# EAGLE design Axios_sensor_connection_autorouted (EAGLE 9.5.1)
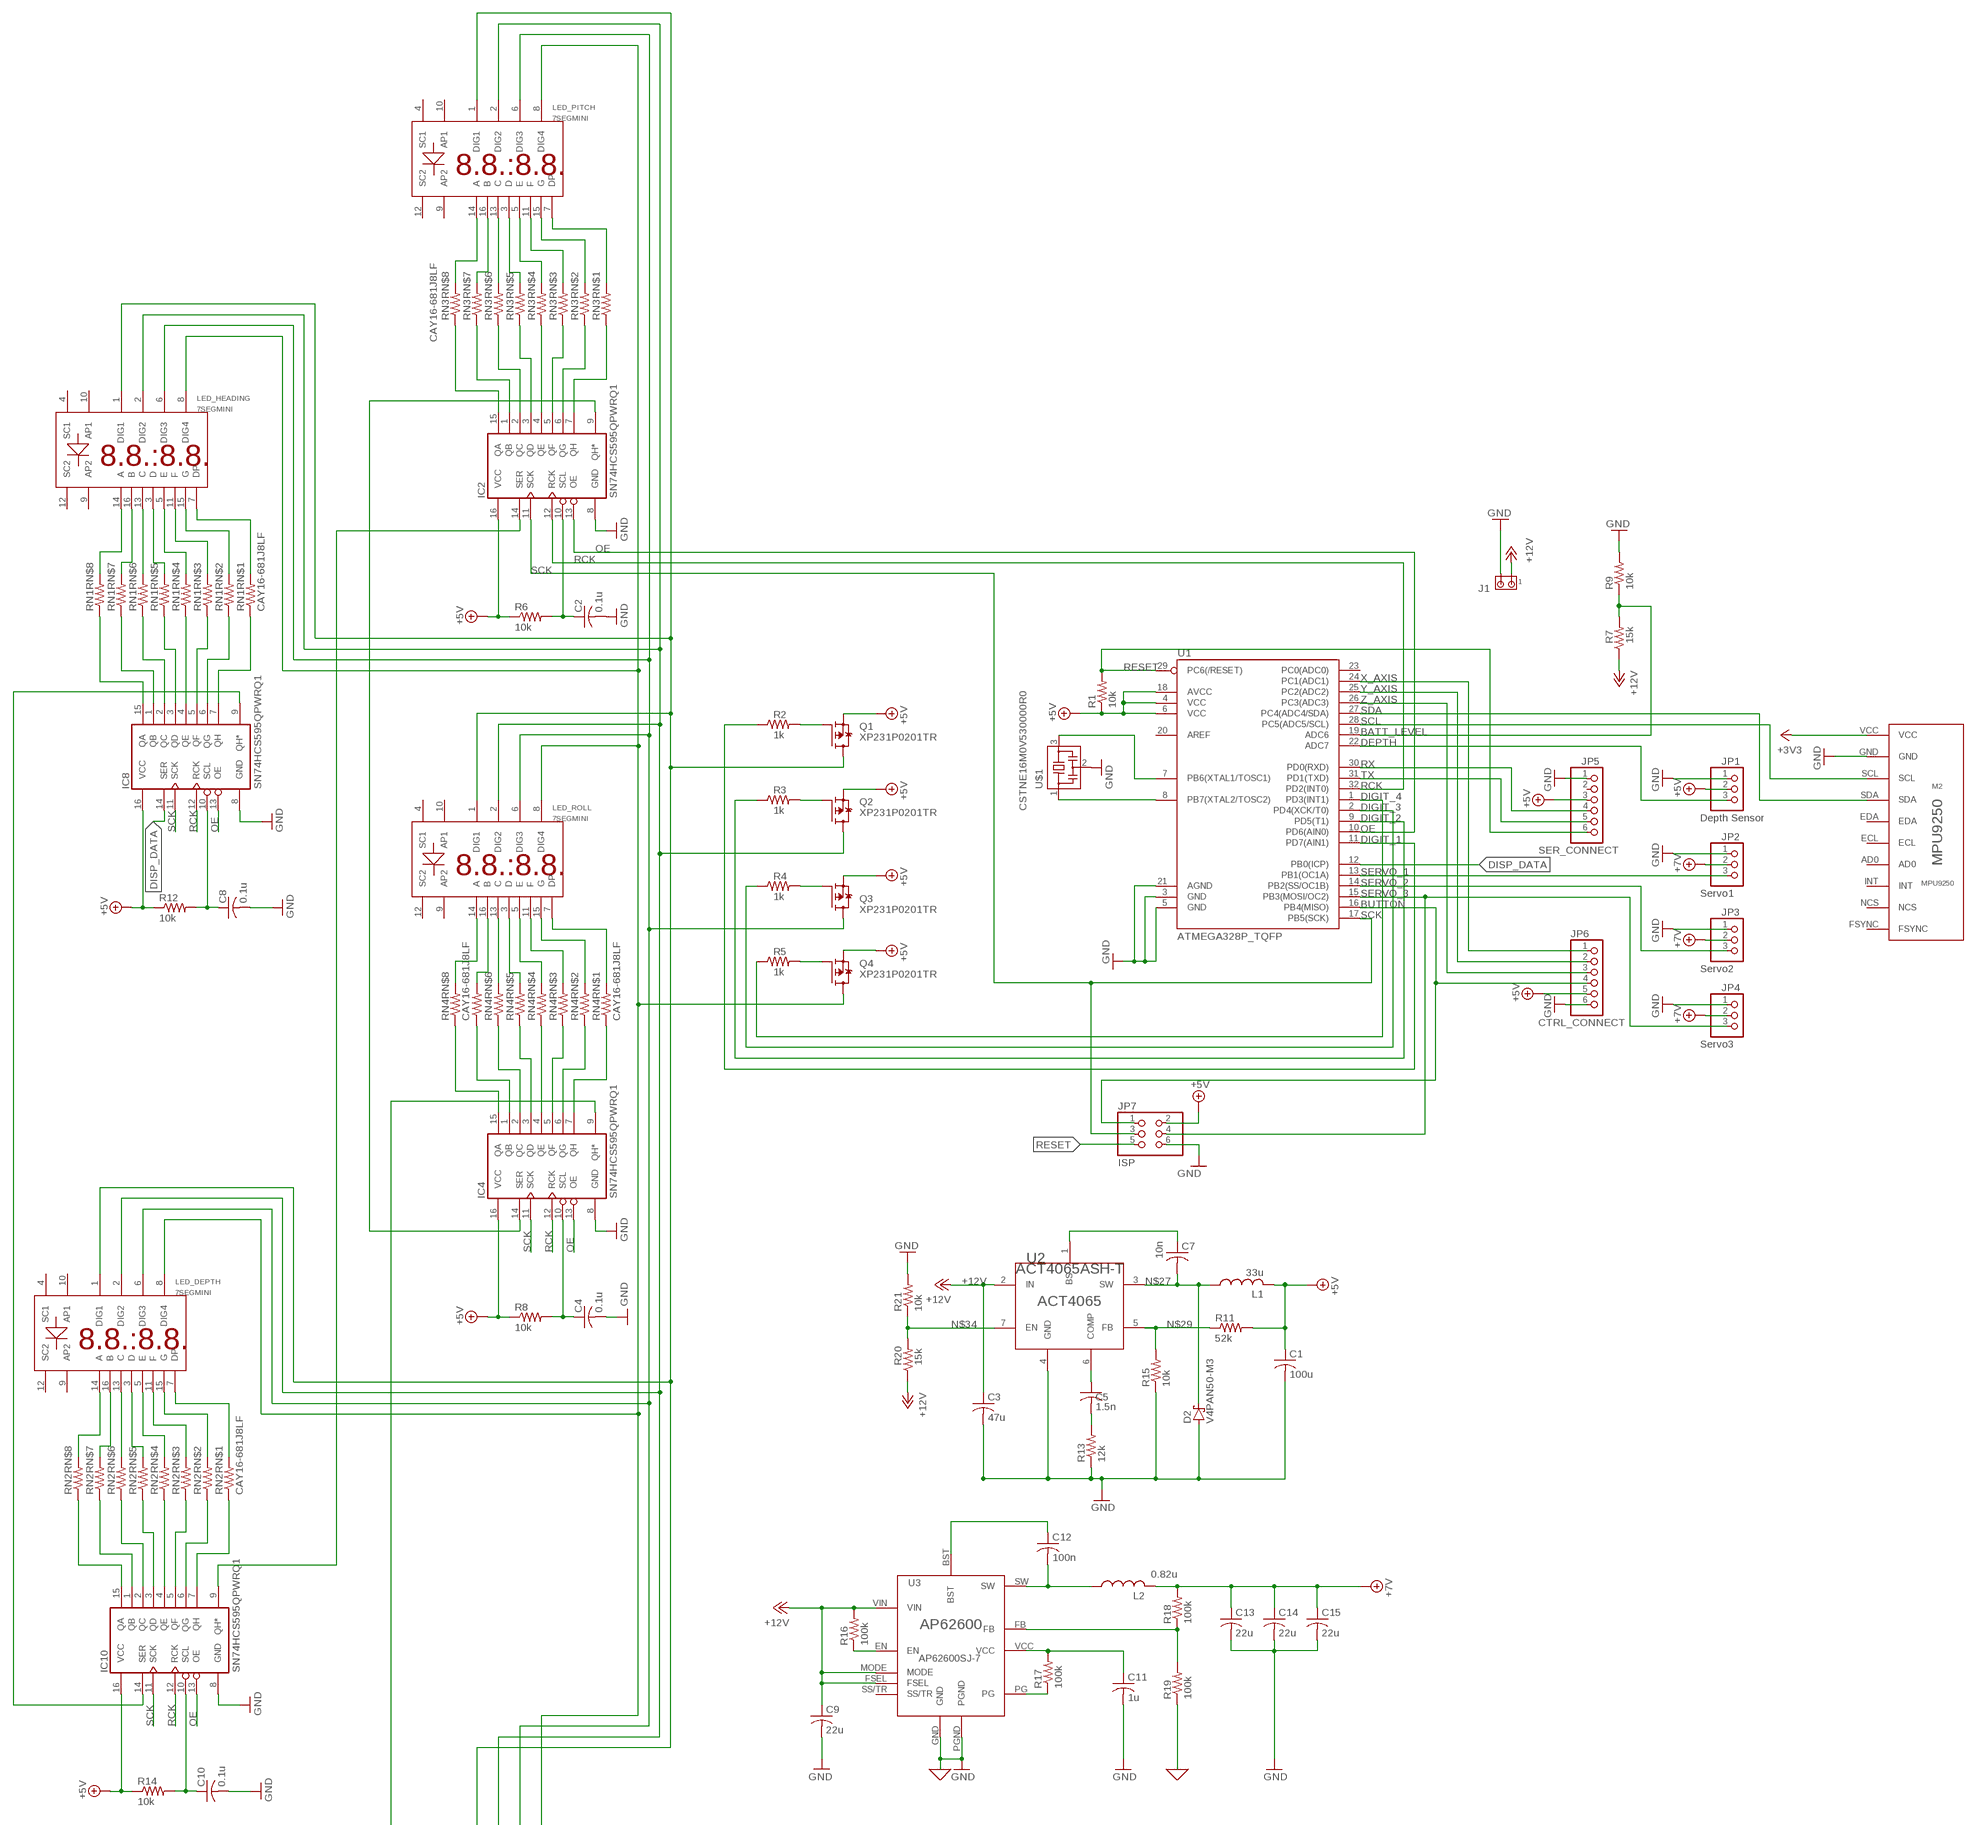
[diagram p0: schematic, sheet 1, part 1 of 2]
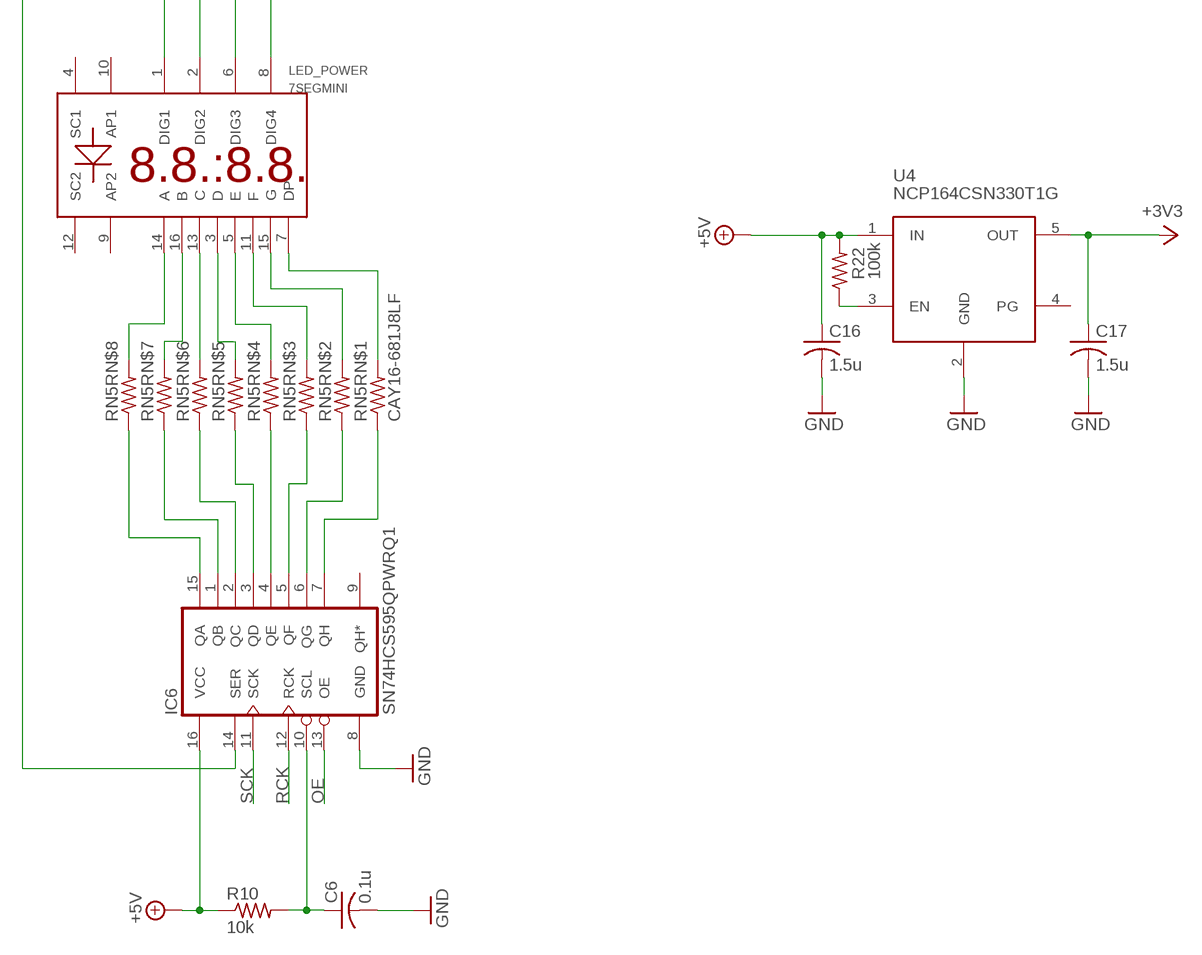
[diagram p1: schematic, sheet 1, part 2 of 2]

## Parts
C1  100u  C-USC0603  [C0603]
C2  0.1u  C-USC0603  [C0603]
C3  47u  C-USC0603  [C0603]
C4  0.1u  C-USC0603  [C0603]
C5  1.5n  C-USC0603  [C0603]
C6  0.1u  C-USC0603  [C0603]
C7  10n  C-USC0603  [C0603]
C8  0.1u  C-USC0603  [C0603]
C9  22u  C-USC0603  [C0603]
C10  0.1u  C-USC0603  [C0603]
C11  1u  C-USC0603  [C0603]
C12  100n  C-USC0603  [C0603]
C13  22u  C-USC0603  [C0603]
C14  22u  C-USC0603  [C0603]
C15  22u  C-USC0603  [C0603]
C16  1.5u  C-USC0603  [C0603]
C17  1.5u  C-USC0603  [C0603]
D2  V4PAN50-M3  [SMPA]
IC2  SN74HCS595QPWRQ1  [TSSOP16]
IC4  SN74HCS595QPWRQ1  [TSSOP16]
IC6  SN74HCS595QPWRQ1  [TSSOP16]
IC8  SN74HCS595QPWRQ1  [TSSOP16]
IC10  SN74HCS595QPWRQ1  [TSSOP16]
J1  MTA02-156  [1X2MTA]
JP1  Depth Sensor  PINHD-1X3  [1X03]
JP2  Servo1  PINHD-1X3  [1X03]
JP3  Servo2  PINHD-1X3  [1X03]
JP4  Servo3  PINHD-1X3  [1X03]
JP5  SER_CONNECT  PINHD-1X6  [1X06]
JP6  CTRL_CONNECT  PINHD-1X6  [1X06]
JP7  ISP  PINHD-2X3  [2X03]
L1  33u  SRN1060-330M  [SRN1060-330M]
L2  0.82u  ECS-MPIL0630-R82MC  [ECS-MPIL0630-R82MC]
LED_DEPTH  7SEGMINI  [7SEGMINI]
LED_HEADING  7SEGMINI  [7SEGMINI]
LED_PITCH  7SEGMINI  [7SEGMINI]
LED_POWER  7SEGMINI  [7SEGMINI]
LED_ROLL  7SEGMINI  [7SEGMINI]
M2  MPU9250  [MPU9250]
Q1  XP231P0201TR  [SOT23]
Q2  XP231P0201TR  [SOT23]
Q3  XP231P0201TR  [SOT23]
Q4  XP231P0201TR  [SOT23]
R1  10k  R-US_R0603  [R0603]
R2  1k  R-US_R0603  [R0603]
R3  1k  R-US_R0603  [R0603]
R4  1k  R-US_R0603  [R0603]
R5  1k  R-US_R0603  [R0603]
R6  10k  R-US_R0603  [R0603]
R7  15k  R-US_R0603  [R0603]
R8  10k  R-US_R0603  [R0603]
R9  10k  R-US_R0603  [R0603]
R10  10k  R-US_R0603  [R0603]
R11  52k  R-US_R0603  [R0603]
R12  10k  R-US_R0603  [R0603]
R13  12k  R-US_R0603  [R0603]
R14  10k  R-US_R0603  [R0603]
R15  10k  R-US_R0603  [R0603]
R16  100k  R-US_R0603  [R0603]
R17  100k  R-US_R0603  [R0603]
R18  100k  R-US_R0603  [R0603]
R19  100k  R-US_R0603  [R0603]
R20  15k  R-US_R0603  [R0603]
R21  10k  R-US_R0603  [R0603]
R22  100k  R-US_R0603  [R0603]
RN1  CAY16-681J8LF  [CAY16-681J8LF]
RN2  CAY16-681J8LF  [CAY16-681J8LF]
RN3  CAY16-681J8LF  [CAY16-681J8LF]
RN4  CAY16-681J8LF  [CAY16-681J8LF]
RN5  CAY16-681J8LF  [CAY16-681J8LF]
U1  ATMEGA328P_TQFP  [TQFP32-08]
U2  ACT4065ASH-T  [SO8]
U3  AP62600SJ-7  [V-QFN2030-12]
U4  NCP164CSN330T1G  [TSOP-5]
U$1  CSTNE16M0V530000R0  [CSTCR6M]

## Nets
0: R19.1 U3.GND U3.PGND ; supply symbol labelled GND
+3V3 [Low Power]: C17.1 M2.VCC U4.5(OUT)
+5V [Low Power]: C1.1 C16.1 IC2.16(VCC) IC4.16(VCC) IC6.16(VCC) IC8.16(VCC) IC10.16(VCC) JP1.2 JP2.2 JP3.2 JP4.2 JP5.3 JP6.5 JP7.2 L1.P$2 Q1.2(S) Q2.2(S) Q3.2(S) Q4.2(S) R6.1 R8.1 R10.1 R11.2 R12.1 R14.1 R22.2 U4.1(IN) ; supply symbol labelled +7V
+7V [Low Power]: C13.1 C14.1 C15.1 L2.P$2 R18.2
+12V [Low Power]: C3.1 C9.1 J1.1 R7.1 R16.2 R20.1 U2.2(IN) U3.FSEL U3.MODE U3.VIN
BATT_LEVEL [Digital]: R7.2 R9.1 U1.19(ADC6)
BUTTON: JP6.4 JP7.1 U1.16(PB4(MISO))
DEPTH [Analog]: JP1.3 U1.22(ADC7)
DIGIT_1 [Digital]: R2.1 U1.11(PD7(AIN1))
DIGIT_2 [Digital]: R3.1 U1.9(PD5(T1))
DIGIT_3 [Digital]: R4.1 U1.2(PD4(XCK/T0))
DIGIT_4 [Digital]: R5.1 U1.1(PD3(INT1))
DISP_DATA [Digital]: IC8.14(SER) U1.12(PB0(ICP))
GND [Medium Power]: C1.2 C2.2 C3.2 C4.2 C6.2 C8.2 C9.2 C10.2 C11.2 C13.2 C14.2 C15.2 C16.2 C17.2 D2.A IC2.8(GND) IC4.8(GND) IC6.8(GND) IC8.8(GND) IC10.8(GND) JP1.1 JP2.1 JP3.1 JP4.1 JP5.1 JP6.6 JP7.6 M2.GND R9.2 R13.1 R15.1 R21.2 U1.3(GND) U1.5(GND) U1.21(AGND) U2.4(GND) U4.2(GND) U$1.2
GND1: R17.1 U3.PG
GND2: R16.1 U3.EN
N$3: R1.1 U1.4(VCC) U1.6(VCC) U1.18(AVCC) ; supply symbol labelled +5V
N$5: IC8.9(QH*) IC10.14(SER)
N$7: U1.8(PB7(XTAL2/TOSC2)) U$1.1
N$12: U1.7(PB6(XTAL1/TOSC1)) U$1.3
N$17: C7.1 U2.1(BS)
N$21: Q1.1(G) R2.2
N$23: Q2.1(G) R3.2
N$24: Q3.1(G) R4.2
N$25: Q4.1(G) R5.2
N$27: C7.2 D2.C L1.P$1 U2.3(SW)
N$29: R11.1 R15.2 U2.5(FB)
N$30: R22.1 U4.3(EN)
N$31: C5.2 R13.2
N$32: J1.2 ; supply symbol labelled GND
N$34: R20.2 R21.1 U2.7(EN)
N$35: C5.1 U2.6(COMP)
N$36: C11.1 R17.2 U3.VCC
N$37: C12.2 L2.P$1 U3.SW
N$42: R18.1 R19.2 U3.FB
N$45: LED_PITCH.14(A) RN3.9
N$46: LED_PITCH.16(B) RN3.10
N$47: LED_PITCH.13(C) RN3.11
N$48: LED_PITCH.3(D) RN3.12
N$49: LED_PITCH.5(E) RN3.13
N$50: LED_PITCH.11(F) RN3.14
N$51: LED_PITCH.15(G) RN3.15
N$52: LED_PITCH.7(DP) RN3.16
N$53: IC2.15(QA) RN3.8
N$54: IC2.1(QB) RN3.7
N$55: IC2.2(QC) RN3.6
N$56: IC2.3(QD) RN3.5
N$57: IC2.4(QE) RN3.4
N$58: IC2.5(QF) RN3.3
N$59: IC2.6(QG) RN3.2
N$60: IC2.7(QH) RN3.1
N$61: C2.1 IC2.10(SCL) R6.2
N$62: C12.1 U3.BST
N$65: IC2.14(SER) IC10.9(QH*)
N$95: LED_ROLL.14(A) RN4.9
N$96: LED_ROLL.16(B) RN4.10
N$97: LED_ROLL.13(C) RN4.11
N$98: LED_ROLL.3(D) RN4.12
N$99: LED_ROLL.5(E) RN4.13
N$100: LED_ROLL.11(F) RN4.14
N$101: LED_ROLL.15(G) RN4.15
N$102: LED_ROLL.7(DP) RN4.16
N$103: IC4.15(QA) RN4.8
N$104: IC4.1(QB) RN4.7
N$105: IC4.2(QC) RN4.6
N$106: IC4.3(QD) RN4.5
N$107: IC4.4(QE) RN4.4
N$108: IC4.5(QF) RN4.3
N$109: IC4.6(QG) RN4.2
N$110: IC4.7(QH) RN4.1
N$111: C4.1 IC4.10(SCL) R8.2
N$115: IC2.9(QH*) IC4.14(SER)
N$145: LED_POWER.14(A) RN5.9
N$146: LED_POWER.16(B) RN5.10
N$147: LED_POWER.13(C) RN5.11
N$148: LED_POWER.3(D) RN5.12
N$149: LED_POWER.5(E) RN5.13
N$150: LED_POWER.11(F) RN5.14
N$151: LED_POWER.15(G) RN5.15
N$152: LED_POWER.7(DP) RN5.16
N$153: IC6.15(QA) RN5.8
N$154: IC6.1(QB) RN5.7
N$155: IC6.2(QC) RN5.6
N$156: IC6.3(QD) RN5.5
N$157: IC6.4(QE) RN5.4
N$158: IC6.5(QF) RN5.3
N$159: IC6.6(QG) RN5.2
N$160: IC6.7(QH) RN5.1
N$161: C6.1 IC6.10(SCL) R10.2
N$165: IC4.9(QH*) IC6.14(SER)
N$195: LED_HEADING.14(A) RN1.9
N$196: LED_HEADING.16(B) RN1.10
N$197: LED_HEADING.13(C) RN1.11
N$198: LED_HEADING.3(D) RN1.12
N$199: LED_HEADING.5(E) RN1.13
N$200: LED_HEADING.11(F) RN1.14
N$201: LED_HEADING.15(G) RN1.15
N$202: LED_HEADING.7(DP) RN1.16
N$203: IC8.15(QA) RN1.8
N$204: IC8.1(QB) RN1.7
N$205: IC8.2(QC) RN1.6
N$206: IC8.3(QD) RN1.5
N$207: IC8.4(QE) RN1.4
N$208: IC8.5(QF) RN1.3
N$209: IC8.6(QG) RN1.2
N$210: IC8.7(QH) RN1.1
N$211: C8.1 IC8.10(SCL) R12.2
N$241: LED_DEPTH.1(DIG1) LED_HEADING.1(DIG1) LED_PITCH.1(DIG1) LED_POWER.1(DIG1) LED_ROLL.1(DIG1) Q1.3(D)
N$242: LED_DEPTH.2(DIG2) LED_HEADING.2(DIG2) LED_PITCH.2(DIG2) LED_POWER.2(DIG2) LED_ROLL.2(DIG2) Q2.3(D)
N$243: LED_DEPTH.6(DIG3) LED_HEADING.6(DIG3) LED_PITCH.6(DIG3) LED_POWER.6(DIG3) LED_ROLL.6(DIG3) Q3.3(D)
N$244: LED_DEPTH.8(DIG4) LED_HEADING.8(DIG4) LED_PITCH.8(DIG4) LED_POWER.8(DIG4) LED_ROLL.8(DIG4) Q4.3(D)
N$245: LED_DEPTH.14(A) RN2.9
N$246: LED_DEPTH.16(B) RN2.10
N$247: LED_DEPTH.13(C) RN2.11
N$248: LED_DEPTH.3(D) RN2.12
N$249: LED_DEPTH.5(E) RN2.13
N$250: LED_DEPTH.11(F) RN2.14
N$251: LED_DEPTH.15(G) RN2.15
N$252: LED_DEPTH.7(DP) RN2.16
N$253: IC10.15(QA) RN2.8
N$254: IC10.1(QB) RN2.7
N$255: IC10.2(QC) RN2.6
N$256: IC10.3(QD) RN2.5
N$257: IC10.4(QE) RN2.4
N$258: IC10.5(QF) RN2.3
N$259: IC10.6(QG) RN2.2
N$260: IC10.7(QH) RN2.1
N$261: C10.1 IC10.10(SCL) R14.2
OE [Digital]: IC2.13(OE) IC4.13(OE) IC6.13(OE) IC8.13(OE) IC10.13(OE) U1.10(PD6(AIN0))
RCK [Digital]: IC2.12(RCK) IC4.12(RCK) IC6.12(RCK) IC8.12(RCK) IC10.12(RCK) U1.32(PD2(INT0))
RESET [Digital]: JP5.6 JP7.5 R1.2 U1.29(PC6(/RESET))
RX: JP5.4 U1.30(PD0(RXD))
SCK [Digital]: IC2.11(SCK) IC4.11(SCK) IC6.11(SCK) IC8.11(SCK) IC10.11(SCK) JP7.3 U1.17(PB5(SCK))
SCL [Digital]: M2.SCL U1.28(PC5(ADC5/SCL))
SDA [Digital]: M2.SDA U1.27(PC4(ADC4/SDA))
SERVO_1 [Medium Power]: JP2.3 U1.13(PB1(OC1A))
SERVO_2 [Medium Power]: JP3.3 U1.14(PB2(SS/OC1B))
SERVO_3 [Medium Power]: JP4.3 JP7.4 U1.15(PB3(MOSI/OC2))
TX: JP5.5 U1.31(PD1(TXD))
X_AXIS [Digital]: JP6.1 U1.24(PC1(ADC1))
Y_AXIS [Digital]: JP6.2 U1.25(PC2(ADC2))
Z_AXIS [Digital]: JP6.3 U1.26(PC3(ADC3))
Unconnected: IC6.9(QH*) JP5.2 LED_DEPTH.4(SC1) LED_DEPTH.9(AP2) LED_DEPTH.10(AP1) LED_DEPTH.12(SC2) LED_HEADING.4(SC1) LED_HEADING.9(AP2) LED_HEADING.10(AP1) LED_HEADING.12(SC2) LED_PITCH.4(SC1) LED_PITCH.9(AP2) LED_PITCH.10(AP1) LED_PITCH.12(SC2) LED_POWER.4(SC1) LED_POWER.9(AP2) LED_POWER.10(AP1) LED_POWER.12(SC2) LED_ROLL.4(SC1) LED_ROLL.9(AP2) LED_ROLL.10(AP1) LED_ROLL.12(SC2) M2.AD0 M2.ECL M2.EDA M2.FSYNC M2.INT M2.NCS U1.20(AREF) U1.23(PC0(ADC0)) U3.SS/TR U4.4(PG)

## Library data of the parts
C1-C17 = rcl:C-US: CAPACITOR, American symbol; SPICEPREFIX: C
D2 = axios_components:V4PAN50-M3
IC2 IC4 IC6 IC8 IC10 = axios_components:SN74HCS595QPWRQ1
J1 = con-amp:MTA02-156: AMP connector
JP1-JP4 = pinhead:PINHD-1X3: PIN HEADER
JP5 JP6 = pinhead:PINHD-1X6: PIN HEADER
JP7 = pinhead:PINHD-2X3: PIN HEADER
L1 = axios_components:SRN1060-330M
L2 = axios_components:ECS-MPIL0630-R82MC
LED_DEPTH LED_HEADING LED_PITCH LED_POWER LED_ROLL = axios_components:7SEGMINI
M2 = diy-modules:MPU9250
Q1-Q4 = axios_components:XP231P0201TR: P-Channel Enhancement mode MOSFET 200 mA
R1-R22 = rcl:R-US_: RESISTOR, American symbol; SPICEPREFIX: R
RN1-RN5 = axios_components:CAY16-681J8LF
U1 = axios_components:ATMEGA328P_TQFP: Popular 328P in QFP Storefront component: ATmega328 - TQFP <https://www.sparkfun.com/products/13448> (COM-13448) Datasheet <http://www.sparkfun.com/datasheets/Components/SMD/ATMega328.pdf> SparkFun Products SparkFun RedBoard - Programmed with Arduino <https://www.sparkfun.com/products/12757> (DEV-12757) Arduino Pro Mini 328 - 5V/16MHz <https://www.sparkfun.com/products/11113> (DEV-11113) Arduino Pro Mini 328 - 3.3V/8MHz <https://www.sparkfun.com/products/11114> (DEV-11114) SparkFun OpenLog <https://www.sparkfun.com/products/13712> (DEV-13712) SparkFun MicroView - OLED Arduino Module <https://www.sparkfun.com/products/12923> (DEV-12923) SparkFun Digital Sandbox <https://www.sparkfun.com/products/12651> (DEV-12651) SparkFun PicoBoard <https://www.sparkfun.com/products/11888> (WIG-11888) Arduino Fio <https://www.sparkfun.com/products/10116> (DEV-10116) LilyPad Arduino 328 Main Board <https://www.sparkfun.com/products/13342> (DEV-13342) SparkFun RedStick <https://www.sparkfun.com/products/13741> (DEV-13741) LilyPad MP3 <https://www.sparkfun.com/products/11013> (DEV-11013) LilyPad Arduino SimpleSnap <https://www.sparkfun.com/products/10941> (DEV-10941) SparkFun Stepoko <https://www.sparkfun.com/products/13899> (ROB-13899) SparkFun Geiger Counter <https://www.sparkfun.com/products/11345> (SEN-11345) SparkFun EL Sequencer <https://www.sparkfun.com/products/12781> (COM-12781) Arduino Pro 328 - 5V/16MHz <https://www.sparkfun.com/products/10915> (DEV-10915) CryptoCape <https://www.sparkfun.com/products/12773> (DEV-12773) SparkFun IR Thermometer Evaluation Board - MLX90614 <https://www.sparkfun.com/products/10740> (SEN-10740) SparkFun RedBot Mainboard <https://www.sparkfun.com/products/12097> (ROB-12097) Arduino Pro 328 - 3.3V/8MHz <https://www.sparkfun.com/products/10914> (DEV-10914) SparkFun Block for Intel® Edison - Arduino <https://www.sparkfun.com/products/13036> (DEV-13036) SparkFun Simon Says - Surface Mount Soldering Kit <https://www.sparkfun.com/products/10935> (KIT-10935) SparkFun 7-Segment Serial Display - Red <https://www.sparkfun.com/products/11441> (COM-11441) SparkFun 7-Segment Serial Display - White <https://www.sparkfun.com/products/11629> (COM-11629) SparkFun 7-Segment Serial Display - Yellow <https://www.sparkfun.com/products/11443> (COM-11443) SparkFun 7-Segment Serial Display - Kelly Green <https://www.sparkfun.com/products/11440> (COM-11440) SparkFun 7-Segment Serial Display - Blue <https://www.sparkfun.com/products/11442> (COM-11442) SparkFun OpenSegment Serial Display - 20mm (Blue) <https://www.sparkfun.com/products/11647> (COM-11647) SparkFun OpenSegment Serial Display - 20mm (Green) <https://www.sparkfun.com/products/11646> (COM-11646) SparkFun OpenSegment Serial Display - 20mm (White) <https://www.sparkfun.com/products/11648> (COM-11648) SparkFun OpenSegment Serial Display - 20mm (Red) <https://www.sparkfun.com/products/11644> (COM-11644) SparkFun OpenSegment Serial Display - 20mm (Yellow) <https://www.sparkfun.com/products/11645> (COM-11645) SparkFun OpenSegment Shield <https://www.sparkfun.com/products/13190> (DEV-13190); PROD_ID: IC-09069
U2 = axios_components:ACT4065ASH-T
U3 = axios_components:AP62600SJ-7
U4 = axios_components:NCP164CSN330T1G
U$1 = axios_components:CSTNE16M0V530000R0

## Net classes
0 default: width 0.203 mm, drill 0.381 mm, clearance 0.203 mm
1 High Power: width 1.016 mm, drill 1.27 mm, clearance 0.203 mm
2 Low Power: width 0.254 mm, drill 0.635 mm, clearance 0.203 mm
3 Analog: width 0.254 mm, drill 0.381 mm, clearance 0.203 mm
4 Digital: width 0.203 mm, drill 0.381 mm, clearance 0.203 mm
5 Medium Power: width 0.381 mm, drill 0.635 mm, clearance 0.203 mm
6 Other: width 0.203 mm, drill 0.381 mm, clearance 0.152 mm

## Board
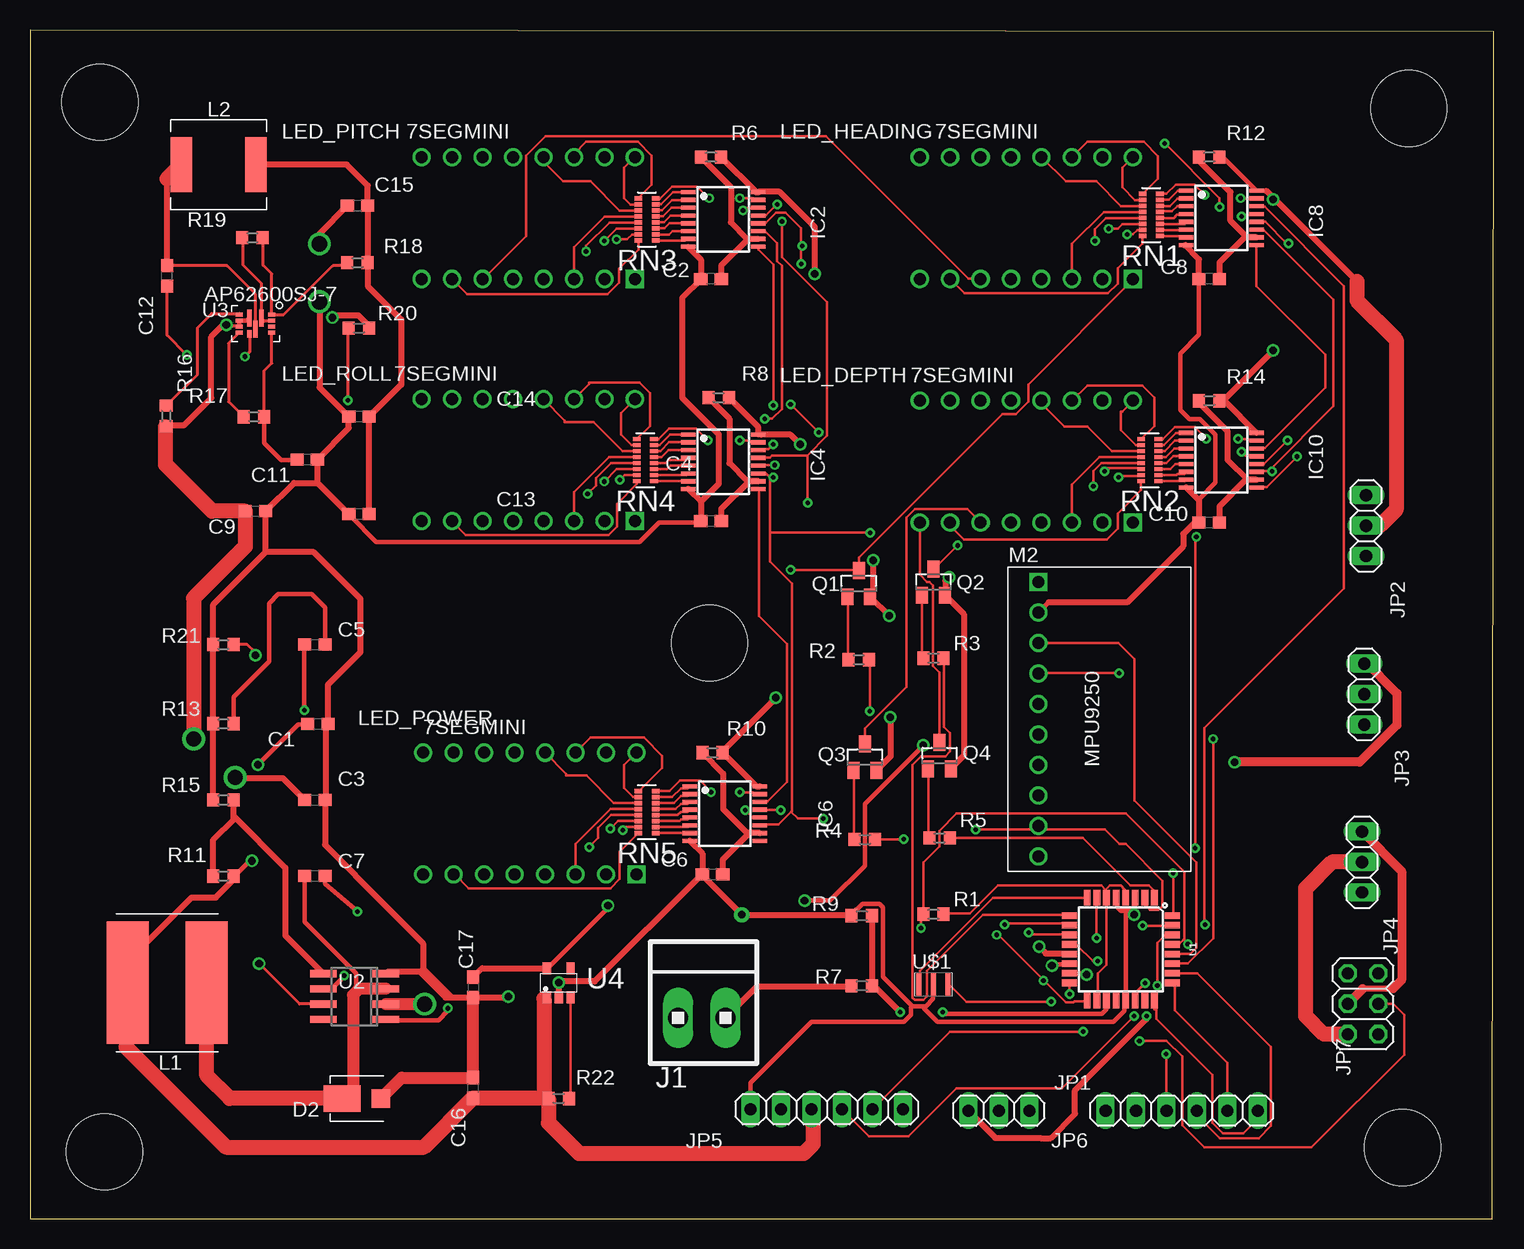
[diagram p2: board, top side]
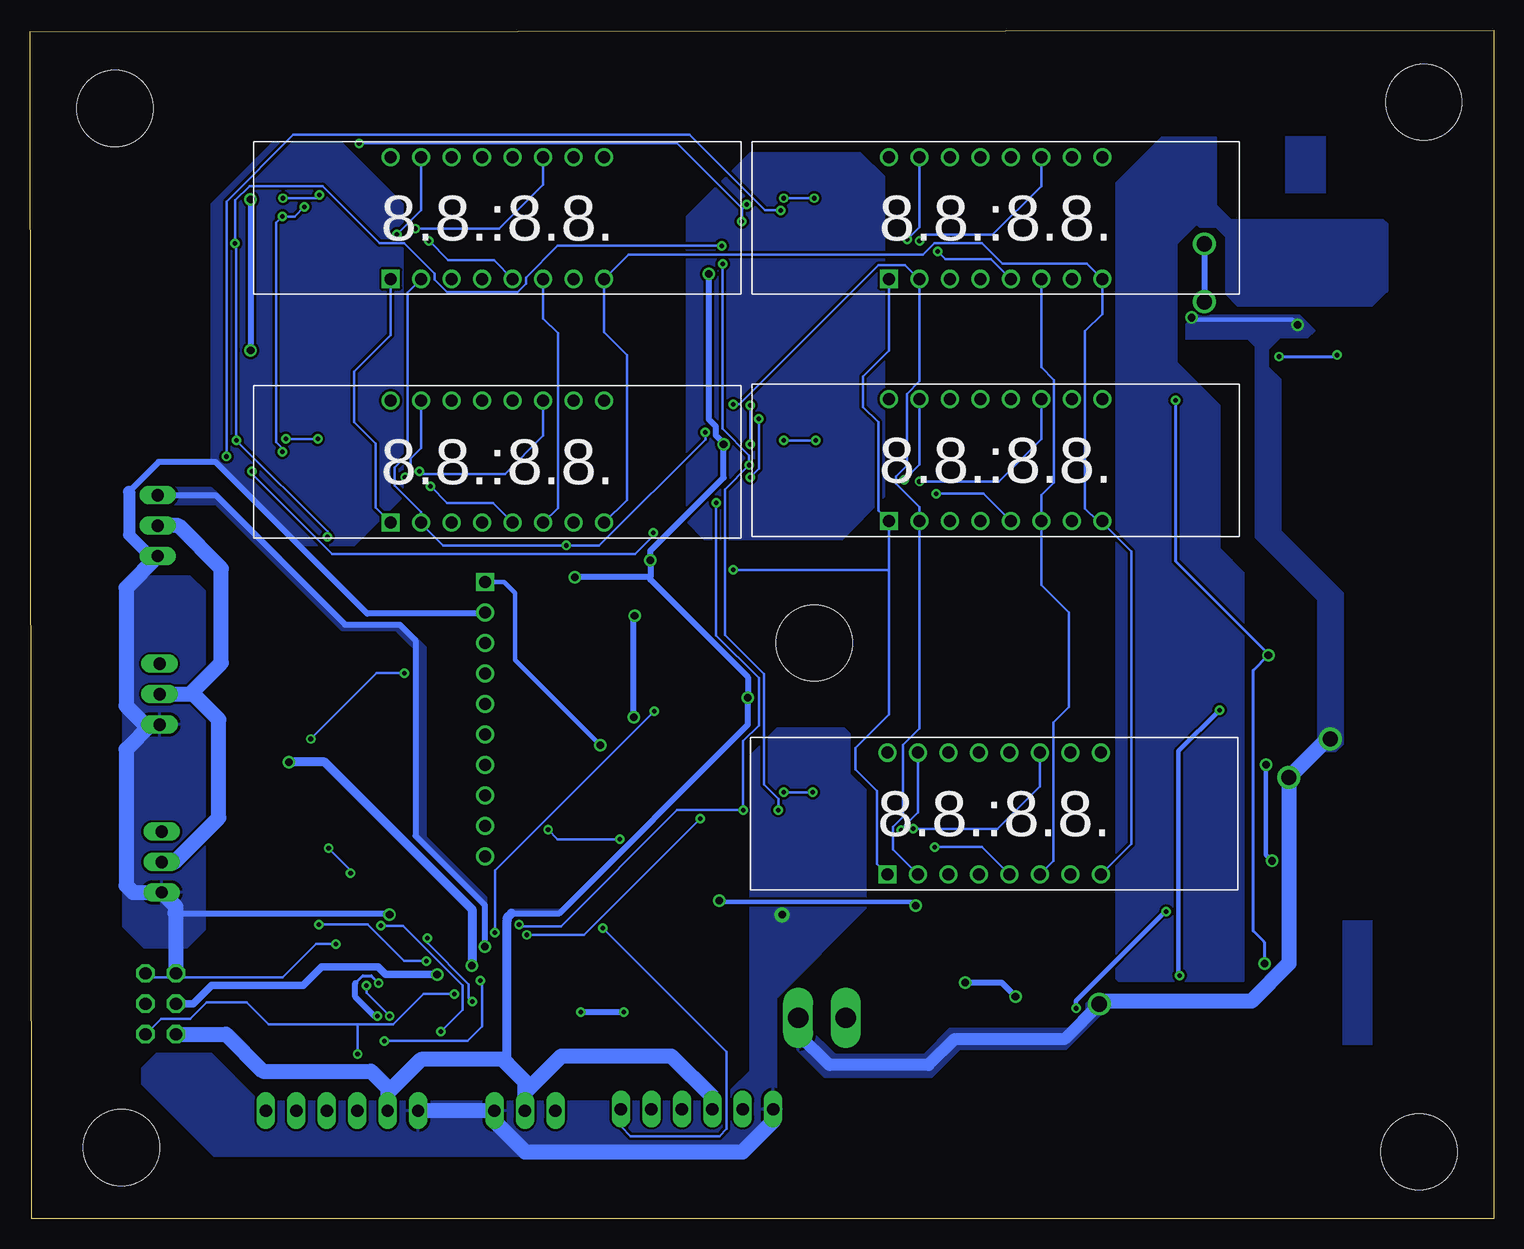
[diagram p3: board, bottom side, seen from below]

Size 122.03 x 99.11 mm. Coordinates in mm from the lower left corner, seen from the top.
Outline: 0,0 121.9,0 122.03,98.98 0,99.11 0,0
Copper layers (1*16): Top 0.035mm / dielectric 1.5mm / Bottom 0.035mm
Design rules "default": minimum track width 6mil, minimum drill 0.35mm, track to track 6mil, track to pad 6mil, pad to pad 6mil, via to via 6mil, smd to smd 6mil, copper to edge 40mil, drill to drill 6mil, minimum pad ring 10mil, minimum via ring 8mil, stop-mask expansion 4mil, vias tented up to drill 0mil, thermal gap 10mil
Holes 6.35 mm at 5.84,93.09 6.22,5.59 114.4,5.94 114.94,92.58 56.64,48.01

### Footprints (pad centres in the part's own frame; a part is rotated, then mirrored left to right if it is on the bottom)
C0603 = smd 1.1 x 1: 1 -0.85,0; 2 0.85,0
SMPA = smd 1.524 x 1.524: A 1.702,0 | smd 3.099 x 2.21: C -1.549,0
TSSOP16 = smd 0.35 x 1.2: 1 -2.275,-2.925; 2 -1.625,-2.925; 3 -0.975,-2.925; 4 -0.325,-2.925; 5 0.325,-2.925; 6 0.975,-2.925; 7 1.625,-2.925; 8 2.275,-2.925; 9 2.275,2.925; 10 1.625,2.925; 11 0.975,2.925; 12 0.325,2.925; 13 -0.325,2.925; 14 -0.975,2.925; 15 -1.625,2.925; 16 -2.275,2.925
1X2MTA = drill 1.676 long: 1 1.981,0; 2 -1.981,0
1X03 = drill 1.016 long: 1 -2.54,0; 2 0,0; 3 2.54,0
1X06 = drill 1.016 long: 1 -6.35,0; 2 -3.81,0; 3 -1.27,0; 4 1.27,0; 5 3.81,0; 6 6.35,0
2X03 = drill 1.016 octagon: 1 -2.54,-1.27; 2 -2.54,1.27; 3 0,-1.27; 4 0,1.27; 5 2.54,-1.27; 6 2.54,1.27
SRN1060-330M = smd 3.5 x 10.2: P$1 -3.3,0; P$2 3.3,0
ECS-MPIL0630-R82MC = smd 1.8 x 4.6: P$1 -3.13,0; P$2 3.1,0
7SEGMINI = drill 1 square: 1 -8.89,-5.08 | drill 1: 2 -6.35,-5.08; 3 -3.81,-5.08; 4 -1.27,-5.08; 5 1.27,-5.08; 6 3.81,-5.08; 7 6.35,-5.08; 8 8.89,-5.08; 9 8.89,5.08; 10 6.35,5.08; 11 3.81,5.08; 12 1.27,5.08; 13 -1.27,5.08; 14 -3.81,5.08; 15 -6.35,5.08; 16 -8.89,5.08
MPU9250 = drill 1: AD0 0,-3.81; ECL 0,-1.27; EDA 0,1.27; FSYNC 0,-11.43; GND 0,8.89; INT 0,-6.35; NCS 0,-8.89; SCL 0,6.35; SDA 0,3.81 | drill 1 square: VCC 0,11.43
SOT23 = smd 1 x 1.4: 1 -0.95,-1.1; 2 0.95,-1.1; 3 0,1.1
R0603 = smd 1 x 1.1: 1 -0.85,0; 2 0.85,0
CAY16-681J8LF = smd 0.35 x 0.65: 1 -1.75,-0.725; 2 -1.25,-0.725; 3 -0.75,-0.725; 4 -0.25,-0.725; 5 0.25,-0.725; 6 0.75,-0.725; 7 1.25,-0.725; 8 1.75,-0.725; 9 1.75,0.725; 10 1.25,0.725; 11 0.75,0.725; 12 0.25,0.725; 13 -0.25,0.725; 14 -0.75,0.725; 15 -1.25,0.725; 16 -1.75,0.725
TQFP32-08 = smd 1.27 x 0.559: 1 -4.293,2.8; 2 -4.293,2; 3 -4.293,1.2; 4 -4.293,0.4; 5 -4.293,-0.4; 6 -4.293,-1.2; 7 -4.293,-2; 8 -4.293,-2.8; 17 4.293,-2.8; 18 4.293,-2; 19 4.293,-1.2; 20 4.293,-0.4; 21 4.293,0.4; 22 4.293,1.2; 23 4.293,2; 24 4.293,2.8 | smd 0.559 x 1.27: 9 -2.8,-4.293; 10 -2,-4.293; 11 -1.2,-4.293; 12 -0.4,-4.293; 13 0.4,-4.293; 14 1.2,-4.293; 15 2,-4.293; 16 2.8,-4.293; 25 2.8,4.293; 26 2,4.293; 27 1.2,4.293; 28 0.4,4.293; 29 -0.4,4.293; 30 -1.2,4.293; 31 -2,4.293; 32 -2.8,4.293
SO8 = smd 0.6 x 2.2: 1 -1.905,-2.6; 2 -0.635,-2.6; 3 0.635,-2.6; 4 1.905,-2.6; 5 1.905,2.6; 6 0.635,2.6; 7 -0.635,2.6; 8 -1.905,2.6
V-QFN2030-12 = smd 0.6 x 0.35: BST 0.85,-0.5 | smd 0.35 x 0.6: EN -0.75,-1.35; FB -0.75,1.35; FSEL 0.25,-1.35; GND -0.25,1.35; MODE -0.25,-1.35; PG 0.75,-1.35; SS/TR 0.25,1.35; VCC 0.75,1.35 | smd 1.4 x 0.35: PGND -0.45,0.5; SW 0.45,0; VIN -0.45,-0.5
TSOP-5 = smd 0.7 x 1: 1 -0.99,-1.2; 2 0,-1.2; 3 0.99,-1.2; 4 0.99,1.2; 5 -0.99,1.2
CSTCR6M = smd 0.4 x 1.9: 1 -1.2,0; 2 0,0; 3 1.2,0

### Placement (x,y rotation side)
C1  24,41.27 0 top
C2  56.77,78.36 180 top
C3  23.75,34.92 0 top
C4  56.77,58.17 180 top
C5  23.75,47.88 0 top
C6  56.9,28.7 180 top
C7  23.75,28.57 180 top
C8  98.3,78.36 180 top
C9  18.8,58.99 0 top
C10  98.3,58.04 180 top
C11  23.11,63.31 0 top
C12  11.43,78.61 90 top
C13  27.43,58.74 180 top
C14  27.43,66.86 180 top
C15  27.3,84.45 180 top
C16  36.96,10.92 90 top
C17  36.96,19.3 270 top
D2  27.56,10.03 0 top
IC2  57.78,83.31 270 top
IC4  57.78,63.12 270 top
IC6  57.91,33.78 270 top
IC8  99.31,83.44 270 top
IC10  99.31,63.25 270 top
J1  56.01,16.76 0 top
JP1  80.77,9.02 180 top
JP2  111.38,57.78 90 top
JP3  111.23,43.74 90 top
JP4  111.05,29.74 90 top
JP5  66.42,9.14 0 top
JP6  96.01,9.02 180 top
JP7  111.12,17.93 90 top
L1  11.43,19.68 180 top
L2  15.75,87.88 0 top
LED_DEPTH  83.06,63.12 0 bottom
LED_HEADING  83.06,83.44 0 bottom
LED_PITCH  41.53,83.44 0 bottom
LED_POWER  41.66,33.78 0 bottom
LED_ROLL  41.53,63.25 0 bottom
M2  84.07,41.66 0 top
Q1  69.09,52.96 0 top
Q2  75.31,53.09 0 top
Q3  69.6,38.48 0 top
Q4  75.82,38.61 0 top
R1  75.31,25.4 180 top
R2  69.09,46.61 180 top
R3  75.31,46.74 180 top
R4  69.6,31.62 180 top
R5  75.82,31.75 180 top
R6  56.77,88.52 180 top
R7  69.34,19.43 0 top
R8  57.4,68.45 180 top
R9  69.34,25.27 180 top
R10  56.9,38.86 180 top
R11  16.13,28.57 0 top
R12  98.3,88.52 180 top
R13  16.13,41.27 0 top
R14  98.3,68.2 180 top
R15  16.13,34.92 0 top
R16  11.37,66.93 270 top
R17  18.67,66.86 0 top
R18  27.3,79.71 0 top
R19  18.54,81.79 0 top
R20  27.43,74.25 180 top
R21  16.13,47.88 180 top
R22  44.07,10.03 180 top
RN1  93.47,83.69 90 top
RN2  93.34,63.25 90 top
RN3  51.44,83.31 90 top
RN4  51.31,63.25 90 top
RN5  51.44,33.91 90 top
U1  90.93,22.48 270 top
U2  27.05,18.54 90 top
U3  18.8,74.64 270 top
U4  44.07,19.68 0 top
U$1  75.31,19.56 0 top

### Tracks (layer width: path | path; a pad name or v marks a point on that pad's centre or on a via)
0
  Top 0.254: U3.GND 20.09,74.83 19.55,74.83 U3.PGND 19.3,77.99 17.78,79.5 17.78,81.7 R19.1
+3V3  (via drill 0.64)
  Top 0.254: 43.26,21.01 U4.5
  Top 0.381: v74.47,39.47 69.6,34.59 69.6,29.44 66.7,26.54 v64.57,26.54 | v48.18,26.11 48.18,25.93 43.26,21.01
  Top 0.508: C17.1 37.69,20.89 U4.5
  Bottom 0.254: 64.47,26.44 v64.57,26.54
  Bottom 0.381: 64.47,26.44 48.51,26.44 v48.18,26.11 | M2.VCC 82.53,53.09 81.61,52.17 81.61,46.61 v74.47,39.47
+5V  (via drill 0.64, 0.64 pad 0.38)
  Top 0.254: L1.P$2 8.13,21.46 | 16.98,28.28 R11.2 17.07,28.6 | 76.81,37.54 Q4.2 | 76.3,51.97 Q2.2 76.3,52.07 | 70.31,52.17 70.1,51.97 Q1.2 | 60.96,65.38 IC4.16 | 57.81,39.06 R10.1 | 103.05,85.7 102.41,85.7 IC8.16 | 99.67,68.43 99.56,68.2 | 23.06,41.2 C1.1
  Top 0.381: IC8.16 99.43,88.52 R12.1 | 76.81,37.59 76.81,37.54 | 23.06,41.2 22.35,41.2 v19,37.85 | v18.49,29.84 18.31,29.84 17.07,28.6
  Top 0.508: IC10.16 99.56,68.2 R14.1 | R6.1 60.55,85.59 IC2.16 60.75,85.62 62.48,85.62 65.43,82.68 v65.43,78.79 | IC4.16 60.71,66 R8.1 | R10.1 60.55,36.06 IC6.16 | 43.18,10.07 R22.2 42.84,10.41 | U4.1 42.98,18.48 42.84,18.34 | 16.98,28.28 15.49,26.8 13.46,26.8 8.13,21.46 | 76.81,37.59 77.85,38.63 77.85,50.42 76.3,51.97 | Q1.2 v71.63,50.27 | 60.96,65.38 63.4,65.38 v64.21,64.57 | 70.31,52.17 v70.31,54.91 | v62.18,43.43 57.81,39.06 | 76.3,52.07 76.3,53.19 v76.61,53.49 | v103.63,72.39 99.67,68.43 | 103.05,85.7 103.63,85.11 v103.63,84.99 103.78,84.99 110.62,78.16 | v71.7,41.83 71.75,41.78 71.75,38.59 Q3.2
  Top 1.27: L1.P$2 8,19.68 8,14.32 16.35,5.97 32.85,5.97 C16.1 43.18,10.07 | 42.84,18.34 42.84,10.41 | R22.2 43.22,8 45.76,5.46 64.52,5.46 65.28,6.22 65.28,9.02 JP5.3 65.15,8.08 | JP7.2 107.87,15.39 106.35,16.92 106.35,27.56 108.53,29.74 JP4.2 | JP2.2 111.43,57.84 112.6,57.84 113.89,59.13 113.89,73.28 110.62,76.56 110.62,78.16
  Bottom 0.254: 70.31,53.49 70.31,53.29 | 64.21,64.67 v64.21,64.57
  Bottom 0.381: v19,37.85 19,30.35 v18.49,29.84
  Bottom 0.508: v64.21,64.57 64.21,61.8 70.31,55.7 v70.31,54.91 70.31,53.49 v76.61,53.49 | 70.31,53.29 62.18,45.16 v62.18,43.43 62.18,41.2 77.9,25.48 81.89,25.48 | v65.43,78.79 65.43,66.65 64.85,66.06 64.85,65.3 64.21,64.67 | v103.63,84.99 v103.63,72.39 | v71.7,41.83 71.75,41.89 71.75,50.14 v71.63,50.27
  Bottom 0.762: 82.25,12.97 82.25,24.92 82.19,25.18 81.89,25.48
  Bottom 1.27: JP5.3 65.15,10.16 68.58,13.59 77.72,13.59 80.77,10.54 JP1.2 80.77,11.41 82.52,13.16 | JP7.2 105.69,15.39 102.62,12.32 93.6,12.32 92.2,10.92 JP6.5 92.2,10.52 89.44,13.28 82.65,13.28 82.52,13.16 | 82.25,12.97 82.52,13.16 | JP4.2 109.98,29.74 106.29,33.43 106.29,41.63 108.41,43.74 JP3.2 108.69,43.74 106.07,46.35 106.07,54.2 109.65,57.78 JP2.2
  pour Bottom: 81.92,25.78 77.85,25.78 77.85,25.4 81.92,25.4
+7V
  Top 0.508: L2.P$2 26.42,87.88 28.16,86.14 C15.1 R18.2 28.16,77.76 30.95,74.97 30.95,69.53 C14.1 C13.1
+12V  (via drill 0.64, 1.27, 1.27 pad 1.27)
  Top 0.254: R16.2 11.44,66.16 | 16.03,74.45 16.36,74.45 | 16.36,74.45 17.45,74.45 | v16.36,74.52 16.36,74.45 | 68.48,19.36 R7.1
  Top 0.381: U3.FSEL 17.45,74.45 U3.MODE 18.08,74.89 18.15,74.96 18.17,74.96 U3.VIN | 11.3,66.02 11.44,66.16 | R20.1 28.28,74.41 | v25.2,75.13 25.38,75.31
  Top 0.508: 11.44,66.16 12.84,66.16 15.11,68.43 15.11,73.53 16.03,74.45 | v17.09,36.8 17.17,36.73 21.1,36.73 C3.1 | 28.28,74.41 27.38,75.31 25.38,75.31 | 68.48,19.36 60.58,19.36 J1.1
  Top 1.016: U2.2 v32.89,17.91
  Top 1.27: 11.3,66.02 11.3,62.87 15.18,58.99 C9.1 17.95,56.05 13.64,51.74 v13.64,40.01 | 17.07,36.8 v17.09,36.8
  Bottom 0.254: 32.49,18.16 v32.89,17.91
  Bottom 0.381: 25.04,74.98 16.82,74.98 v16.36,74.52
  Bottom 0.508: 16.94,36.6 17.02,36.6 17.07,36.55 | 25.04,74.98 v25.2,75.13
  Bottom 1.016: v32.89,17.91 35.81,14.99 44.96,14.99 47.12,12.83 55.37,12.83 57.99,15.44 J1.1
  Bottom 1.27: 32.49,18.16 20.19,18.16 17.07,21.29 17.07,36.55 17.07,36.78 v17.09,36.8 13.89,40.01 v13.64,40.01
  pour Bottom: 14.88,74.07 16.15,75.34 24.92,75.34 25.7,74.55 25.7,73.38 25.65,73.33 20.52,73.33 19.94,72.75 19.94,56.85 14.73,51.64 14.73,39.42 14.27,38.96 13.16,38.96 12.52,39.6 12.52,52.15 17.73,57.35 17.73,69.95 18.75,70.97 18.75,72.52 17.81,73.46 15.49,73.46
  pour Bottom: 57.07,15.9 57.07,18.14 57.53,18.59 58.47,18.59 58.98,18.08 58.98,14.96 55.8,11.79 46.84,11.79 44.5,14.12 35.64,14.12 32.44,17.32 32.44,17.93 33.02,18.52 33.45,18.52 34.04,17.93 34.04,17.25 35.41,15.88 45.36,15.88 47.52,13.72 54.89,13.72
BATT_LEVEL  (via drill 0.38)
  Top 0.203: 70.21,19.46 R7.2 70.31,19.46 | 70.21,25.25 R9.1 | 89.71,18.14 U1.19
  Top 0.381: 89.71,18.14 89.71,17.45 89.36,17.09 76.22,17.09 v76.1,17.22
  Top 0.508: 70.21,25.25 70.21,19.46 | 70.31,19.46 v72.54,17.22
  Bottom 0.508: v72.54,17.22 v76.1,17.22
BUTTON  (via drill 0.38)
  Top 0.203: v86.67,18.75 86.67,19.66 U1.16 | v94.72,13.74 94.72,9.07 JP6.4
  Bottom 0.203: v86.67,18.75 89.2,18.75 91.75,16.2 94.72,16.2 | 94.72,16.2 102.13,16.2 103.96,18.03 107.31,18.03 108.66,16.69 111.1,16.69 JP7.1 | 94.72,16.2 v94.72,13.74
COOLING_PLATE_1
  pour Bottom: 14.02,90.2 17.37,90.2 17.37,85.55 14.02,85.55
COOLING_PLATE_2
  pour Bottom: 10.13,24.84 12.6,24.84 12.6,14.55 10.13,14.55
DEPTH  (via drill 0.38)
  Top 0.254: v92.96,19.66 92.15,18.85 92.15,18.24 U1.22 | 78.26,8.97 JP1.3
  Top 0.508: v93.07,16.92 93.07,16.66 87.12,10.72 87.12,8.76 85.09,6.73 84.23,6.73 84.25,6.76 80.47,6.76 78.26,8.97
  Bottom 0.254: v92.96,19.66 93.57,20.27 94.28,20.27 94.92,19.63
  Bottom 0.508: 94.92,19.63 94.92,18.52 93.32,16.92 v93.07,16.92
DIGIT_1  (via drill 0.38)
  Top 0.203: v70,42.32 70,46.58 R2.1 | v83.26,23.85 83.39,23.72 86.56,23.72 U1.11
  Bottom 0.203: v70,42.32 83.26,29.06 v83.26,23.85
DIGIT_2
  Top 0.203: R3.1 76.2,46.69 76.2,41 76.71,40.49 76.71,38.96 76.3,38.56 74.27,38.56 73.56,37.85 73.56,18.44 73.76,18.24 74.47,18.24 74.78,18.54 74.78,20.68 79.45,25.35 86.56,25.35 U1.9
DIGIT_3  (via drill 0.38)
  Top 0.203: v72.85,31.65 70.51,31.65 R4.1 | v78.84,32.46 89.61,32.46 90.83,31.24 91.34,31.24 94.39,28.19 94.39,26.06 94.08,25.76 93.37,25.76 92.96,26.16 92.96,26.77 U1.2
  Bottom 0.203: v72.85,31.65 78.03,31.65 v78.84,32.46
DIGIT_4
  Top 0.203: R5.1 87.78,31.75 91.75,27.79 93.27,27.79 93.67,27.38 93.67,26.77 U1.1
DISP_DATA  (via drill 0.38)
  Top 0.203: v97.94,24.54 97.89,24.59 97.89,40.92 109.53,52.55 109.53,77.78 102.92,84.38 102.31,84.38 IC8.14 | v89,21.49 88.59,21.49 87.27,22.81 86.67,22.81 U1.12
  Bottom 0.203: v97.94,24.54 93.88,24.54 90.83,21.49 v89,21.49
GND  (via drill 0.64, 0.64 pad 1.27, 1.27 pad 0.38)
  Top 0.381: 24.64,34.96 C3.2 | C8.2 97.45,73.7 95.89,72.14 95.89,67.44 96.65,66.67 97.54,66.67 98.83,65.38 98.83,61.37 97.45,59.98 97.45,59.91 | 84.91,51.38 M2.GND | 97.05,58.01 97.13,58.04 C10.2 | C4.2 55.68,58.06 52.43,58.06 50.8,56.44 28.85,56.44 26.72,58.57 C13.2 | 91.75,25.65 91.34,25.65 | 91.34,25.65 90.93,25.65 90.63,25.96 90.63,26.77 U1.5 | 91.75,25.65 92.05,25.96 92.05,26.77 U1.3 | 91.34,25.65 91.34,18.24 U1.21 91.24,18.03 91.24,17.32 90.32,16.41 75.67,16.41 74.51,17.56 74.68,17.73 | 68.49,25.3 R9.2 68.58,25.45 69.39,26.26 70.81,26.26 71.12,25.96 71.12,20.17 73.56,17.73 | 56.19,28.5 C6.2 55.88,28.6 | 74.68,17.73 75.29,18.34 75.29,19.56 U$1.2 | 73.56,17.73 74.68,17.73 | 44.27,19.79 v44.07,19.68 | JP5.1 60.07,11.33 65.15,16.41 72.85,16.41 73.46,17.02 73.46,17.63 73.56,17.73 | 91.75,25.65 v92.05,25.35
  Top 0.508: IC8.8 96.38,81.15 96.27,81.15 97.45,79.97 C8.2 | IC2.8 55.92,79.98 C2.2 54.36,76.8 54.36,68.45 57.4,65.41 57.4,61.27 55.92,59.78 | IC4.8 55.92,59.78 | 55.92,59.78 C4.2 | IC10.8 97.45,59.91 C10.2 | IC6.8 56.05,30.45 C6.2 | 35.14,18.45 32.77,20.83 32.77,22.98 27.11,28.64 27.11,28.67 24.6,31.18 C3.2 | 35.14,18.45 C17.2 39.79,18.45 v39.88,18.54 | v44.07,19.68 U4.2 | C13.2 23.96,61.36 | 23.96,61.36 C11.2 26.58,65.93 C14.2 24.13,69.32 v24.13,76.45 | C15.2 24.13,82.13 v24.13,81.28 | R15.1 15.23,34.98 15.23,41.22 R13.1 R21.2 15.28,51.22 19.65,55.59 | 19.65,55.59 C9.2 22.01,61.36 23.96,61.36 | 19.65,55.59 23.66,55.59 27.56,51.69 27.56,47.24 24.85,44.54 C1.2 24.64,41.03 24.64,34.96 | U2.4 29.78,20.57 32.51,20.57 34.63,18.45 35.14,18.45 | 84.91,51.38 91.47,51.38 96.14,56.06 96.14,57.1 97.05,58.01 | 68.49,25.3 59.38,25.3 v59.33,25.35 56.19,28.5 | 44.27,19.79 47.07,19.79 55.88,28.6
  Top 1.016: D2.A 31,11.77 C16.2 C17.2
  Bottom 0.381: 84.07,50.44 M2.GND
  Bottom 0.508: v39.88,18.54 41.02,19.68 v44.07,19.68 | v24.13,81.28 v24.13,76.45 | 113.77,60.63 111.3,63.09 106.55,63.09 93.9,50.44 84.07,50.44 | 109.93,25.48 92.18,25.48 v92.05,25.35
  Bottom 1.016: JP2.1 111.99,55.24 113.77,57.02 113.77,60.63
  Bottom 1.27: JP5.1 60.07,8.13 62.61,5.59 80.77,5.59 83.31,8.13 JP1.1 JP6.6 | JP2.1 114.02,52.6 114.02,42.77 112.45,41.2 JP3.1 111.96,41.2 114.02,39.14 114.02,27.79 113.44,27.2 JP4.1 | JP4.1 109.93,26.09 109.93,25.48 | JP7.6 109.86,26.01 JP4.1
  pour Bottom: 23.11,90.17 27.69,90.17 31.5,86.36 31.5,20.07 31.24,19.81 20.83,19.81 20.83,53.85 22.86,55.88 22.86,67.82 26.42,71.37 26.42,81.28 23.11,84.58
  pour Bottom: 52.83,88.9 61.98,88.9 67.31,83.57 67.31,58.17 65.79,56.64 54.36,56.64 50.8,60.2 50.8,86.87
  pour Bottom: 90.93,84.58 96.01,89.66 101.85,89.66 106.93,84.58 106.93,63.25 99.82,56.13 95,56.13 90.93,60.2
  pour Bottom: 108.71,53.59 113.28,53.59 114.3,52.58 114.3,24.38 112.52,22.61 108.97,22.61 107.44,24.13 107.44,52.32
  pour Bottom: 59.36,9.42 59.74,9.8 102.95,9.8 106.93,13.79 111.48,13.79 112.73,12.55 112.73,11.28 106.65,5.21 94.16,5.21 94.13,5.23 62.36,5.23 59.66,7.92 59.51,7.92 59.36,8.08
  pour Bottom: 23.65,85.22 25.22,83.64 25.45,83.64 24.49,82.68 23.14,82.68 22.35,81.89 22.35,77.11 21.34,76.1 10.19,76.1 9.02,77.27 8.94,77.27 8.84,77.37 8.84,82.91 9.25,83.31 21.97,83.31 23.11,84.45 23.11,84.58 23.27,84.73 23.27,84.96 23.52,85.22
  pour Bottom: 54.15,40.92 59.72,40.92 62.03,38.61 62.03,12.29 63.58,10.74 63.58,7.8 62.36,6.58 60.93,6.58 59.82,7.7 59.82,18.44 52.35,25.91 52.35,35.74 53.67,37.06 53.67,40.44
GND1
  Top 0.254: U3.PG 16.56,73 16.56,68.12 R17.1
GND2
  Top 0.203: U3.EN 17.48,75.44 17.45,75.47
  Top 0.254: R16.1 13.97,70.38 13.97,74.3 15.14,75.47 17.45,75.47
N$3
  Top 0.203: 89.66,27.43 89.71,27.38 89.71,26.77 | 89.66,27.43 89.31,27.79 80.67,27.79 78.33,25.45 76.2,25.45 R1.1 | 89.71,26.77 89.71,21.18 89,20.47 89,18.24 U1.18 | 89.71,26.77 U1.6 | 89.66,27.43 90.02,27.79 90.93,27.79 91.24,27.48 91.24,26.77 U1.4
N$5
  Top 0.203: IC8.9 102.24,77.77 107.97,72.03 107.97,69.32 102.92,64.26 102.31,64.26 IC10.14
N$7
  Top 0.203: U1.8 80.26,26.77 74.17,20.68 74.17,19.56 U$1.1
N$12  (via drill 0.38)
  Top 0.203: v88.9,23.42 88.9,26.77 U1.7 | v85.14,18.11 78.05,18.11 76.61,19.56 U$1.3
  Bottom 0.203: v88.9,23.42 88.9,23.01 85.45,19.56 85.45,18.41 v85.14,18.11
N$17  (via drill 0.38)
  Top 0.203: v27.3,25.63 v27.3,25.64
  Top 0.381: v34.82,17.55 34.82,17.32 34.06,16.56 29.73,16.56 U2.1 | v27.3,25.64 24.6,27.93 C7.1
  Bottom 0.381: v27.3,25.63 27.38,25.63 34.82,18.19 v34.82,17.55
N$21
  Top 0.203: R2.2 68.17,46.69 68.17,51.77 Q1.1
N$23
  Top 0.203: R3.2 74.37,46.79 74.37,51.97 Q2.1
N$24
  Top 0.203: R4.2 68.68,31.65 68.68,37.34 Q3.1
N$25
  Top 0.203: R5.2 74.88,31.75 74.88,37.44 Q4.1
N$27
  Top 0.381: C7.2 22.9,24.75 27.2,20.45 27.2,19.58 27.43,19.18
  Top 1.016: U2.3 27.43,19.18 26.92,18.67 26.92,10.95 D2.C
  Top 1.27: D2.C 16.64,10.03 14.73,11.94 L1.P$1
N$29
  Top 0.508: R11.1 15.28,31.61 16.98,33.31 16.98,33.58 | 16.98,33.58 R15.2 | 16.98,33.58 21.29,29.27 21.29,23.61 U2.5
N$30
  Top 0.203: U4.3 45.06,10.17 R22.1
N$31
  Top 0.381: R13.2 16.98,43.52 19.94,46.48 19.94,51.31 20.7,52.07 23.5,52.07 24.6,50.97 C5.2
N$34  (via drill 0.38, 0.64 pad 0.38)
  Top 0.203: 26.52,74.22 R20.2
  Top 0.254: U2.7 22.48,17.91 v19.1,21.29 | v18.8,46.99 18.8,47.2 18.12,47.88 R21.1 | v26.52,68.22 26.52,74.22
  Bottom 0.254: v19.1,21.29 19.15,21.34 19.15,23.09 20.07,24 20.07,45.72 v18.8,46.99 18.92,47.22 26.52,54.81 v26.52,68.22
N$35  (via drill 0.38)
  Top 0.203: U2.6 25.15,19.18 | 22.86,47.8 C5.1
  Top 0.381: v22.86,42.42 22.86,47.8 | v26.19,20.3 26.19,20.22 25.15,19.18
  Bottom 0.203: v26.19,20.3 26.29,20.4
  Bottom 0.381: v22.86,42.42 26.29,38.99 26.29,20.4
N$36
  Top 0.203: U3.VCC 20.22,73.81 20.15,73.81
  Top 0.254: R17.2 19.52,70.7 20.15,71.33 20.15,73.81 U3.VCC
  Top 0.381: R17.2 19.52,64.68 20.95,63.25 22.2,63.25 C11.1
N$37
  Top 0.254: C12.2 16.42,79.46 18.8,77.09 U3.SW
  Top 0.508: C12.2 11.43,86.7
  Top 1.27: 11.43,86.7 L2.P$1
N$42
  Top 0.254: R19.2 19.43,81.75 19.43,79.5 20.15,78.79 U3.FB 21.16,75.39 25.23,79.46 26.2,79.46 R18.1
N$45
  Top 0.203: LED_PITCH.14 45.34,88.77 46.35,89.79 50.67,89.79 51.82,88.65 51.82,86.23 50.71,85.13 RN3.9
N$46
  Top 0.203: LED_PITCH.16 49.53,87.63 49.53,85.09 50.06,84.56 RN3.10
N$47
  Top 0.203: LED_PITCH.13 42.8,88.14 44.45,86.49 46.74,86.49 49.16,84.06 RN3.11
N$48
  Top 0.203: LED_PITCH.3 45.34,81.03 47.88,83.56 RN3.12
N$49  (via drill 0.38)
  Top 0.203: v46.35,80.64 46.35,81.12 48.29,83.06 RN3.13
  Bottom 0.203: LED_PITCH.5 41.91,80.01 45.72,80.01 v46.35,80.64
N$50  (via drill 0.38)
  Top 0.203: RN3.14 48.91,82.56 v47.88,81.53
  Bottom 0.203: LED_PITCH.11 37.72,86.11 41.78,82.04 47.37,82.04 v47.88,81.53
N$51  (via drill 0.38)
  Top 0.203: v48.9,81.66 49.78,81.66 50.19,82.06 RN3.15
  Bottom 0.203: LED_PITCH.15 47.88,82.68 v48.9,81.66
N$52
  Top 0.203: LED_PITCH.7 36.45,77.09 48.13,77.09 49.11,78.06 49.11,79.2 50.71,80.81 RN3.16
N$53  (via drill 0.38)
  Top 0.203: RN3.8 52.52,85.06 53.52,86.07 55.59,86.07 56.56,85.09 v56.64,85.09 | v59.18,85.09 60.26,85.09 60.32,85.03 60.62,85.03 IC2.15
  Bottom 0.203: v56.64,85.09 v59.18,85.09
N$54
  Top 0.203: RN3.7 52.18,84.58 52.61,84.58 53.62,85.59 IC2.1
N$55
  Top 0.203: RN3.6 52.18,84.08 52.69,84.08 53.54,84.94 IC2.2
N$56
  Top 0.203: RN3.5 52.18,83.58 52.76,83.58 53.47,84.29 IC2.3
N$57
  Top 0.203: RN3.4 52.18,83.08 52.84,83.08 53.39,83.64 IC2.4
N$58
  Top 0.203: RN3.3 52.18,82.58 52.91,82.58 53.31,82.99 IC2.5
N$59
  Top 0.203: RN3.2 53.27,82.06 53.54,82.34 IC2.6
N$60
  Top 0.203: RN3.1 54.59,81.56 54.63,81.6 54.77,81.6 IC2.7
N$61
  Top 0.508: R6.2 58.42,86.02 58.42,83.06 59.79,81.69 IC2.10 59.84,81.69 57.62,79.46 C2.1
N$62  (via drill 0.38)
  Top 0.254: U3.BST 18.3,72.27 v17.91,71.88 | v13.08,72.01 11.43,73.66 C12.1
  Bottom 0.254: v17.91,71.88 13.21,71.88 v13.08,72.01
N$65  (via drill 0.38)
  Top 0.203: v59.44,84.07 59.64,84.28 60.66,84.28 IC2.14 | v105.64,63.55 103.1,61.01 102.31,61.01 IC10.9
  Bottom 0.203: v59.44,84.07 60.76,84.07 67.06,90.37 100.08,90.37 105.64,84.81 v105.64,63.55
N$95
  Top 0.203: LED_ROLL.14 46.61,69.6 46.61,69.72 50.8,69.72 51.69,68.83 51.69,66.1 RN4.9
N$96
  Top 0.203: LED_ROLL.16 49.28,67.18 49.28,65.37 50.15,64.5 RN4.10
N$97
  Top 0.203: LED_ROLL.13 44.58,66.55 44.58,66.42 46.99,66.42 49.41,64 RN4.11
N$98
  Top 0.203: LED_ROLL.3 45.34,60.58 48.26,63.5 RN4.12
N$99  (via drill 0.38)
  Top 0.203: v46.48,60.45 47.18,61.15 47.18,61.76 48.42,63 RN4.13
  Bottom 0.203: LED_ROLL.5 42.55,60.45 v46.48,60.45
N$100  (via drill 0.38)
  Top 0.203: v47.88,61.47 48.91,62.5 RN4.14
  Bottom 0.203: LED_ROLL.11 37.72,65.02 41.27,61.47 v47.88,61.47
N$101  (via drill 0.38)
  Top 0.203: v49.15,61.59 49.55,62 RN4.15
  Bottom 0.203: LED_ROLL.15 47.88,62.87 v49.15,61.59
N$102
  Top 0.203: LED_ROLL.7 36.32,57.02 48.23,57.02 48.94,57.73 48.94,59.61 50.58,61.25 RN4.16
N$103  (via drill 0.38)
  Top 0.203: RN4.8 52.39,65 53.27,65.87 55.54,65.87 v56.52,64.9 | IC4.15 60.67,64.71 60.13,64.71 59.94,64.9 v59.18,64.9
  Bottom 0.203: v59.18,64.9 v56.52,64.9
N$104
  Top 0.203: RN4.7 52.05,64.52 52.48,64.52 53.36,65.39 IC4.1
N$105
  Top 0.203: RN4.6 52.05,64.02 52.56,64.02 53.29,64.74 IC4.2
N$106
  Top 0.203: RN4.5 52.05,63.52 52.63,63.52 53.21,64.09 IC4.3
N$107
  Top 0.203: IC4.4 54.69,63.27 53.24,63.27 52.97,63 RN4.4
N$108
  Top 0.203: RN4.3 53.12,62.5 53.41,62.79 IC4.5
N$109
  Top 0.203: RN4.2 54.71,62 IC4.6
N$110
  Top 0.203: RN4.1 IC4.7
N$111
  Top 0.508: R8.2 58.29,66.71 58.29,62.99 59.79,61.49 IC4.10 60.69,61.48 59.92,61.48 57.62,59.17 C4.1
N$115  (via drill 0.38)
  Top 0.203: v61.98,64.57 61.57,64.16 60.76,64.16 IC4.14 | v61.98,67.82 61.98,79.55 60.71,80.82 IC2.9
  Bottom 0.203: v61.98,67.82 v61.98,64.57
N$145
  Top 0.203: LED_POWER.14 46.74,40.13 51.18,40.13 52.7,38.61 52.7,37.59 50.77,35.66 RN5.9
N$146
  Top 0.203: RN5.10 50.69,35.18 50.26,35.18 49.53,35.91 49.53,37.85 LED_POWER.16
N$147
  Top 0.203: LED_POWER.13 44.7,37.08 44.7,36.96 46.38,36.96 48.66,34.68 50.69,34.68 RN5.11
N$148
  Top 0.203: LED_POWER.3 45.47,31.24 48.38,34.16 RN5.12
N$149  (via drill 0.38)
  Top 0.203: v46.61,30.99 47.37,31.75 47.37,32.57 48.46,33.66 RN5.13
  Bottom 0.203: LED_POWER.5 42.67,30.99 v46.61,30.99
N$150  (via drill 0.38)
  Top 0.203: v48.39,32.51 49.03,33.16 RN5.14
  Bottom 0.203: LED_POWER.11 37.85,36.07 41.4,32.51 v48.39,32.51
N$151  (via drill 0.38)
  Top 0.203: v49.4,32.38 49.68,32.66 50.7,32.66 RN5.15
  Bottom 0.203: v49.4,32.38 49.09,32.7 49.09,32.8 48.01,33.88 LED_POWER.15
N$152
  Top 0.203: LED_POWER.7 35.43,28.7 36.58,27.56 48.39,27.56 49.15,28.32 49.15,30.6 RN5.16
N$153  (via drill 0.38)
  Top 0.203: RN5.8 53.31,35.66 54.19,36.54 55.84,36.54 56.77,35.61 v56.77,35.56 | v59.18,35.56 60.26,35.56 60.32,35.5 60.75,35.5 IC6.15
  Bottom 0.203: v59.18,35.56 v56.77,35.56
N$154
  Top 0.203: IC6.1 54.82,35.89 54.26,35.89 53.53,35.16 RN5.7
N$155
  Top 0.203: IC6.2 54.82,35.24 54.26,35.24 53.68,34.66 RN5.6
N$156
  Top 0.203: IC6.3 54.82,34.59 54.26,34.59 53.83,34.16 RN5.5
N$157
  Top 0.203: IC6.4 54.82,33.94 54.26,33.94 53.98,33.66 RN5.4
N$158
  Top 0.203: RN5.3 54.13,33.16 54.26,33.29 54.82,33.29 IC6.5
N$159
  Top 0.203: RN5.2 54.84,32.66 IC6.6
N$160
  Top 0.203: RN5.1 IC6.7
N$161
  Top 0.508: R10.2 57.78,37.12 57.78,34.16 59.79,32.16 IC6.10 59.97,32.16 57.75,29.93 C6.1
N$165
  Top 0.203: IC4.9 60.76,60.81 60.76,50.24 63.09,47.9 63.09,36.42 61.47,34.8 60.86,34.8 IC6.14
N$195
  Top 0.203: RN1.9 94.02,86.72 94.02,88.6 92.84,89.79 88.14,89.79 LED_HEADING.14
N$196
  Top 0.203: RN1.10 92.11,84.94 91.06,86 91.06,87.63 LED_HEADING.16
N$197
  Top 0.203: RN1.11 90.94,84.44 88.9,86.49 86.36,86.49 LED_HEADING.13
N$198
  Top 0.203: RN1.12 92.73,83.92 89.5,83.92 86.87,81.29 LED_HEADING.3
N$199  (via drill 0.38)
  Top 0.203: v88.77,81.53 88.77,82.52 89.7,83.44 RN1.13
  Bottom 0.203: v88.77,81.53 87.17,79.93 83.36,79.93 LED_HEADING.5
N$200  (via drill 0.38)
  Top 0.203: RN1.14 91.07,82.94 90.68,82.55 v89.92,82.55
  Bottom 0.203: LED_HEADING.11 79.25,86.23 82.93,82.55 v89.92,82.55
N$201  (via drill 0.38)
  Top 0.203: RN1.15 92.73,82.42 92.3,82.42 91.95,82.07 v91.44,82.07
  Bottom 0.203: LED_HEADING.15 89.41,84.07 91.41,82.07 v91.44,82.07
N$202
  Top 0.203: LED_HEADING.7 77.89,77.17 89.87,77.17 90.68,77.98 90.68,79.24 92.75,81.31 RN1.16
N$203  (via drill 0.38)
  Top 0.203: RN1.8 94.22,85.47 94.74,85.47 95.5,86.23 97.08,86.23 97.92,85.39 v97.92,85.34 | v100.93,85.09 100.95,85.06 IC8.15
  Bottom 0.203: v97.92,85.34 98.17,85.09 v100.93,85.09
N$204
  Top 0.203: RN1.7 94.22,84.96 94.95,84.96 95.7,85.71 IC8.1
N$205
  Top 0.203: RN1.6 95.01,84.44 95.63,85.06 IC8.2
N$206
  Top 0.203: RN1.5 94.24,83.99 95.2,83.99 95.63,84.41 IC8.3
N$207
  Top 0.203: RN1.4 95.34,83.44 95.62,83.72 96.35,83.72 IC8.4
N$208
  Top 0.203: IC8.5 96.22,82.94 RN1.3
N$209
  Top 0.203: RN1.2 96.37,82.44 IC8.6
N$210
  Top 0.203: RN1.1 96.26,81.94 IC8.7
N$211
  Top 0.508: R12.2 97.45,88.23 100.08,85.6 100.08,83.2 101.45,81.83 102.22,81.83 IC8.10 101.25,81.81 99.15,79.72 C8.1
N$241  (via drill 0.38)
  Top 0.203: v63.4,54.1 69.09,54.1 | 69.09,54.1 69.09,55.12 81.08,67.11 82.19,67.11 83.21,68.12 83.21,69.55 91.95,78.28 LED_HEADING.1 | 69.09,54.1 Q1.3
  Bottom 0.203: LED_PITCH.1 50.42,72.39 52.58,70.23 52.58,67.69 51.31,66.42 51.31,59.05 LED_ROLL.1 50.42,54.1 | 50.42,54.1 50.42,42.04 53.21,39.24 53.21,37.47 51.44,35.69 51.44,29.59 LED_POWER.1 | LED_HEADING.1 91.95,73.66 95,70.61 95,66.42 93.22,64.64 93.22,59.31 LED_DEPTH.1 | 50.42,54.1 v63.4,54.1
N$242  (via drill 0.38)
  Top 0.203: v77.32,56.13 75.39,54.2 Q2.3 | v63.4,67.92 v65.73,65.58
  Bottom 0.203: LED_POWER.2 50.1,30.8 50.1,32.67 49.28,33.5 49.28,39.5 47.88,40.89 LED_ROLL.2 47.88,59.34 49.85,61.31 49.85,61.88 48.94,62.79 48.94,68.77 47.88,69.82 LED_PITCH.2 47.95,78.38 49.07,79.5 51.31,79.5 62.89,67.92 v63.4,67.92 | LED_HEADING.2 90.55,77.22 90.55,63.69 91.63,62.61 91.63,61.15 89.41,58.93 LED_DEPTH.2 89.41,57.96 87.58,56.13 v77.32,56.13 74.57,56.13 65.73,64.97 v65.73,65.58
N$243
  Top 0.203: Q3.3 69.6,40.89 73.05,44.35 73.05,58.47 73.76,59.18 78.13,59.18 79.25,58.06 LED_DEPTH.6 | LED_HEADING.6 79.25,78.38 78.23,78.38 66.34,90.27 42.98,90.27 41.35,88.65 41.35,81.94 37.8,78.38 LED_PITCH.6
  Bottom 0.203: LED_PITCH.6 37.72,70.99 36.66,69.93 36.66,61.38 37.72,60.33 LED_ROLL.6 37.72,52.83 35.43,50.55 35.43,42.67 36.7,41.4 36.7,29.84 LED_POWER.6 | LED_HEADING.6 79.25,75.06 78.02,73.83 78.02,59.27 LED_DEPTH.6
N$244
  Top 0.203: LED_DEPTH.8 74.17,53.7 74.78,53.09 74.98,53.09 75.29,52.78 75.29,46.08 75.79,45.57 75.79,39.78 Q4.3
  Bottom 0.203: LED_DEPTH.8 72.26,59.94 72.26,72.01 74.17,73.91 LED_HEADING.8 72.14,80.39 47.6,80.39 46.64,81.34 42.67,81.34 40.95,79.63 33.91,79.63 LED_PITCH.8 32.64,75.44 34.08,74 34.08,59.23 33.02,58.17 LED_ROLL.8 32.64,58.04 30.23,55.63 30.23,31.24 LED_POWER.8
N$245
  Top 0.203: LED_DEPTH.14 88.14,69.47 92.71,69.47 93.73,68.45 93.73,66.1 RN2.9
N$246
  Top 0.203: LED_DEPTH.16 91.06,67.31 90.93,67.31 90.93,65.75 92.19,64.5 RN2.10
N$247
  Top 0.203: LED_DEPTH.13 84.33,67.94 86.23,66.04 88.14,66.04 90.18,64 RN2.11
N$248
  Top 0.203: LED_DEPTH.3 86.87,61.21 89.15,63.5 RN2.12
N$249  (via drill 0.38)
  Top 0.203: v88.65,61.09 88.65,62 88.63,62.02 88.63,62.34 89.3,63.01 89.87,63.01 89.88,63 RN2.13
  Bottom 0.203: LED_DEPTH.5 83.44,59.69 87.25,59.69 v88.65,61.09
N$250  (via drill 0.38)
  Top 0.203: v89.58,62.31 89.85,62.57 92.54,62.57 RN2.14
  Bottom 0.203: LED_DEPTH.11 79.25,65.28 82.42,62.1 89.38,62.1 v89.58,62.31
N$251  (via drill 0.38)
  Top 0.203: RN2.15 92.54,61.92 90.85,61.92 v90.75,61.82
  Bottom 0.203: LED_DEPTH.15 89.41,64.26 90.3,63.37 90.3,62.28 v90.75,61.82
N$252
  Top 0.203: RN2.16 92.62,60.74 90.68,58.8 90.68,57.53 89.79,56.64 77.85,56.64 76.71,57.78 LED_DEPTH.7
N$253  (via drill 0.38)
  Top 0.203: RN2.8 94.43,65 95.43,66 97.11,66 98.04,65.07 v98.04,65.02 | IC10.15 102.15,64.96 101.59,64.96 101.53,65.02 v100.71,65.02
  Bottom 0.203: v100.71,65.02 v98.04,65.02
N$254
  Top 0.203: RN2.7 94.09,64.52 94.52,64.52 95.53,65.52 IC10.1
N$255
  Top 0.203: RN2.6 94.09,64.02 94.6,64.02 95.45,64.87 IC10.2
N$256
  Top 0.203: RN2.5 94.09,63.52 94.67,63.52 95.38,64.22 IC10.3
N$257
  Top 0.203: RN2.4 94.09,63.02 94.75,63.02 95.3,63.57 IC10.4
N$258
  Top 0.203: RN2.3 94.09,62.52 95.07,62.52 95.48,62.92 IC10.5
N$259
  Top 0.203: RN2.2 95.56,62 95.66,62.1 96.22,62.1 IC10.6
N$260
  Top 0.203: RN2.1 95.64,61.5 96.27,61.5 IC10.7
N$261
  Top 0.508: R14.2 97.45,68.03 99.82,65.66 99.82,63.27 101.47,61.62 IC10.10 101.37,61.62 99.15,59.4 C10.1
OE  (via drill 0.38)
  Top 0.203: v62.59,34.09 60.86,34.09 IC6.13 | v81.25,24.51 81.38,24.64 86.43,24.64 U1.10 | v100.99,63.96 101.3,63.65 102.21,63.65 IC10.13 | v100.99,83.57 101.4,83.57 101.5,83.67 102.21,83.67 IC8.13 | 64.82,63.65 61.87,63.65 61.67,63.45 60.76,63.45 IC4.13 | 64.82,63.65 66.45,65.28 66.45,76.43 62.69,80.19 v62.69,83.16 | v62.28,84.58 61.37,83.67 60.76,83.67 IC2.13 | v99.16,84.38 99.16,85.09 v94.59,89.66 | 64.82,63.65 v64.82,59.69
  Bottom 0.203: v81.25,24.51 81.13,24.38 77.78,24.38 68.07,34.09 v62.59,34.09 62.59,39.83 61.27,41.15 61.27,45.09 64.82,48.64 v64.82,59.69 | v100.99,63.96 100.99,64.26 101.5,64.77 101.5,83.06 v100.99,83.57 99.97,83.57 v99.16,84.38 | v62.69,83.16 62.69,84.18 62.64,84.23 | v62.28,84.58 62.64,84.23 | v94.59,89.66 68.07,89.66 62.64,84.23
RCK  (via drill 0.38)
  Top 0.203: v62.08,62.84 60.76,62.84 IC4.12 | 64.29,81.13 64.29,82.58 62.99,83.87 62.18,83.87 61.37,83.06 60.76,83.06 IC2.12 | 64.29,81.13 v64.29,79.6 | v59.64,34.09 60.25,33.48 60.76,33.48 IC6.12 | v104.83,64.9 102.87,62.94 102.31,62.94 IC10.12 | v104.93,81.33 104.75,81.33 102.97,83.11 IC8.12 | v95.3,28.8 95.3,25.35 U1.32 | v97.23,56.84 97.13,56.74 v97.13,30.89 | v64.36,81.13 64.29,81.13
  Bottom 0.203: v64.29,79.6 64.29,65.86 62.08,63.65 v62.08,62.84 64.11,60.81 64.11,48.67 60.86,45.41 60.86,36.22 59.64,35 v59.64,34.09 | v97.13,30.89 95.3,29.06 v95.3,28.8 | v97.23,56.84 97.23,57.3 v104.83,64.9 104.85,64.92 104.85,81.33 v104.93,81.33 104.93,84.91 103.73,86.11 97.64,86.11 92.86,81.33 90.83,81.33 88.29,78.79 88.29,78.28 87.27,77.27 81.38,77.27 80.67,77.98 80.67,78.49 78.03,81.13 v64.36,81.13
RESET  (via drill 0.38)
  Top 0.203: 96.16,23.27 95.81,22.91 95.3,22.91 U1.29 | 96.16,23.27 96.22,23.32 96.22,28.91 91.34,33.78 77.22,33.78 75.79,32.36 75.79,31.04 74.47,29.72 74.47,25.45 R1.2 74.37,25.35 74.27,25.25 v74.27,24.23 | 96.16,23.27 v96.52,22.91
  Bottom 0.203: v74.27,24.23 63.96,13.92 63.96,7.49 64.57,6.88 71.96,6.88 72.77,7.7 JP5.6 | v96.52,22.91 98.15,22.91 100.95,20.12 112.28,20.12 JP7.5
RX  (via drill 0.38)
  Top 0.203: v93.98,19.46 93.98,23.01 94.59,23.62 95.2,23.62 U1.30 | v92.05,16.92 86.03,10.9 77.24,10.9 73.23,6.88 69.95,6.88 JP5.4
  Bottom 0.203: v93.98,19.46 93.98,18.85 v92.05,16.92
SCK  (via drill 0.38)
  Top 0.203: 103.38,62.48 108.64,67.74 108.64,76.63 102.82,82.45 102.31,82.45 IC8.11 | 103.38,62.48 103.23,62.33 102.31,62.33 IC10.11 | 63.45,33.93 63.5,33.98 63.5,52.98 61.67,54.81 61.67,57.2 | 63.45,33.93 62.38,32.87 60.86,32.87 IC6.11 | 61.67,61.82 61.67,57.2 | 61.67,61.82 61.37,62.13 60.76,62.13 IC4.11 | v61.27,66.7 61.87,66.7 62.69,67.51 62.69,79.45 62.28,79.86 62.28,81.33 61.27,82.35 60.76,82.35 IC2.11 | 61.67,61.82 v61.98,61.82 | 84.48,19.91 80.72,23.67 v80.59,23.67 | 84.48,19.91 86.36,18.03 86.97,18.03 87.07,18.14 88.09,18.14 U1.17 | v66.14,33.38 64.01,33.38 63.45,33.93 | v92.48,14.83 94.75,14.83 96.05,13.53 96.05,7.81 97.91,5.96 106.82,5.96 114.55,13.69 114.55,17.02 113.64,17.93 JP7.3 | 84.48,19.91 v84.48,19.86 | v103.53,62.33 103.38,62.48 | 61.67,57.2 v70.05,57.2
  Bottom 0.203: v61.27,66.7 61.27,62.53 v61.98,61.82 | v80.59,23.67 75.84,23.67 v66.14,33.38 | v92.48,14.83 92.46,14.86 85.55,14.86 84.35,16.05 84.35,19.74 v84.48,19.86 | v103.53,62.33 103.53,62.13 96.83,55.42 71.58,55.42 70.05,56.95 v70.05,57.2
SCL
  Top 0.203: U1.28 95.3,22.1 96.72,22.1 97.23,22.61 97.23,29.72 92.05,34.9 92.05,46.69 90.73,48.01 M2.SCL
SDA  (via drill 0.38)
  Top 0.203: v98.63,40.01 98.63,23.39 96.52,21.29 95.3,21.29 U1.27 | v90.81,45.49 84.1,45.49 M2.SDA
  Bottom 0.203: v90.81,45.49 93.14,45.49 v98.63,40.01
SERVO_1  (via drill 0.64)
  Top 0.381: 86.46,22.12 U1.13
  Top 0.508: 86.46,22.12 84.68,22.12 v84.12,22.68
  Bottom 0.508: v84.12,22.68 84.12,26.16 89.89,31.93 89.89,48.21 91.21,49.53 95.76,49.53 106.55,60.33 JP2.3
  pour Bottom: 106.5,60.55 106.93,60.99 111.23,60.99 111.68,60.53 111.68,60.02 111.23,59.56 111.15,59.56 105.82,59.56 105.82,59.87
  pour Bottom: 106.93,60.99 106.88,60.99 106.4,60.5 95.66,49.76 95.63,49.76 95.58,49.71 91.24,49.71 89.87,48.34 89.87,47.83 90.09,47.6 90.09,47.57 91.52,49 96.01,49 106.93,59.92
  pour Bottom: 89.83,48.5 89,47.68 89,31.37 89.15,31.22 89.38,31.22 90.07,31.9 90.07,48.26
  pour Bottom: 89.36,32.54 89.71,32.54 89.71,31.78 89.66,31.72
  pour Bottom: 83.95,26.16 84.33,26.16 89.41,31.24 89.41,31.75 89.15,32 83.95,26.8
SERVO_2  (via drill 0.64)
  Top 0.381: U1.14 86.59,21.23 85.32,21.23 v85.19,21.11 | 111.23,46.53 JP3.3
  Top 0.762: v100.43,38.08 110.85,38.08 113.94,41.17 113.94,43.81 111.23,46.53
  Bottom 0.762: v85.19,21.11 85.19,25.81 97.46,38.08 v100.43,38.08
SERVO_3  (via drill 0.64)
  Top 0.381: v88.09,20.37 87.99,20.47 86.67,20.47 U1.15
  Top 0.508: 113.61,19.18 111.1,19.18
  Top 0.762: JP7.4 111.1,19.18 | 113.61,19.18 114.35,19.91 114.35,28.98 JP4.3
  Bottom 0.635: v88.09,20.37 92.38,20.37 93.02,21.01 97.71,21.01 99.26,19.46 106.88,19.46 108.41,17.93 JP7.4
TX  (via drill 0.38)
  Top 0.203: v92.76,24.43 95.2,24.43 U1.31 | v87.78,15.6 76.68,15.6 JP5.5
  Bottom 0.203: v92.76,24.43 90.93,24.43 85.95,19.46 85.95,17.42 v87.78,15.6
X_AXIS
  Top 0.203: 93.73,17.48 U1.24 93.91,18.01 93.91,16.68 98.58,12.01 98.58,7.99 99.43,7.14 101.14,7.14 102.36,8.36 JP6.1
Y_AXIS
  Top 0.203: U1.25 95.43,19.63 95.43,17.37 99.8,13.01 99.8,9.07 JP6.2
Z_AXIS
  Top 0.203: U1.26 95.3,20.47 97.33,20.47 103.45,14.35 103.45,7.75 102.44,6.73 99.19,6.73 97.36,8.56 97.36,8.97 JP6.3